# Altium schematic sheet NCP177.SchDoc
size A4; SheetNumber: 7; SheetTotal: 16
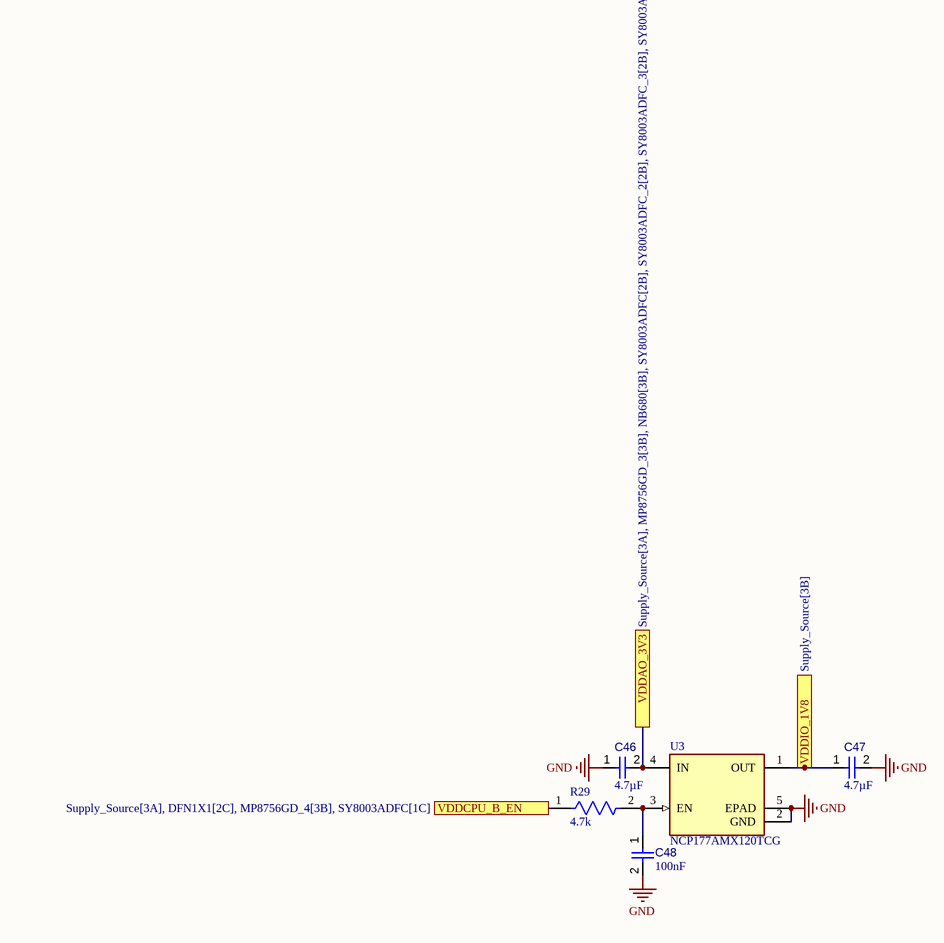
[diagram p0: NCP177.SchDoc]

## Parts
C46  value 4.7µF  [CAPC0603(1608)100_L]  (hidden comment: Capacitor 4.7µF +/-20% 10V 0603)
C47  value 4.7µF  [CAPC0603(1608)100_L]  (hidden comment: Capacitor 4.7µF +/-20% 10V 0603)
C48  value 100nF  [CAPC1005X56X25LL10T15]  (hidden comment: Capacitor 0.1 uF +/- 5% 16 V 0402)
R29  value 4.7k  [FP-RMCF0201-IPC_A]  (hidden comment: RMCF0201JT4K70)
U3  NCP177AMX120TCG  [FP-711AJ-MFG]

## Ports
VDDAO_3V3 (see Supply_Source[3A], MP8756GD_3[3B], NB680[3B], SY8003ADFC[2B], SY8003ADFC_2[2B], SY8003ADFC_3[2B], SY8003ADFC_4[2C], TLV76701[1B]), VDDCPU_B_EN (see Supply_Source[3A], DFN1X1[2C], MP8756GD_4[3B], SY8003ADFC[1C]), VDDIO_1V8 (see Supply_Source[3B])

## Nets
GND: C46.1 C47.2 C48.2 U3.2(GND) U3.5(EPAD)
VDDAO_3V3: C46.2 U3.4(IN) ; port VDDAO_3V3
VDDCPU_B_EN: R29.1 ; port VDDCPU_B_EN
VDDIO_1V8: C47.1 U3.1(OUT) ; port VDDIO_1V8
NetC48_1: C48.1 R29.2 U3.3(EN)

## Library data of the parts
C46 C47 = CMP-001-00076-4: Chip Capacitor, 4.7µF +/-20%, 10V, 0603, Thickness 1 mm; Tolerance: 10%; Mounting Technology: SMT; Case/Package: 0603; Pins: 2; Min Operating Temperature: -55°C; Max Operating Temperature: 85°C; Voltage Rating: 10V
C48 = CMP-001-00001-6: Chip Capacitor, 0.1 uF, +/- 5%, 16 V, 0402 (1005 Metric); Capacitor Type: Ceramic; Voltage Rating: 16V; Max Operating Temperature: 125°C; Min Operating Temperature: -55°C; Case/Package: 0402; Mounting Technology: SM; Pins: 2; Tolerance: 5%; RoHS Compliant: True
R29 = CMP-009-00207-1: Res Thick Film 0201 4.7K Ohm 5% 0.05W(1/20W) ±200ppm/C Pad SMD Automotive T/R; Voltage Rating: 25V; Case/Package: 0201; Tolerance: 5%; Mounting Technology: Surface Mount; Min Operating Temperature: -55°C; Max Operating Temperature: 155°C
U3 = CMP-07128-000002-1: IC REG LINEAR 1.2V 500MA 4XDFN; Manufacturer: ON Semiconductor; Dropout Voltage: 295mV; Max Supply Voltage: 5.5V; Nominal Supply Current: 60uA; Accuracy Percentage: 1.2%; Output Type: Fixed; Standoff Height: 0mm; Min Supply Voltage: 1.6V; Max Junction Temp: +150°C; Number Of Outputs: 1; Output Current: 500mA; ComponentLink2Description: Datasheet; Temperature: to +150°C; Category: IC; Device Class L3: Voltage Regulators - Linear; Manufacturer Part Number: NCP177AMX120TCG; RoHS: TRUE; Lead Free: Yes; Octopart: https://octopart.com/ncp177amx120tcg-on+semiconductor-67320276; Device Class L1: Integrated Circuits (ICs); Mouser Description: LDO Voltage Regulators FAST TRANSIENT RESPO; Digikey Description: IC REG LINEAR 1.2V 500MA 4XDFN; ComponentLink2URL: https://www.onsemi.com/pub/Collateral/NCP177-D.PDF; Output Voltage: 1.2V; Device Class L2: Power Management ICs; Package: 711AJ; Height: 0.43mm; Automotive: No; Footprint Url: https://www.onsemi.com/pub/Collateral/711AJ.PDF; Temperature Range High: +150°C